# Altium schematic sheet overview.SchDoc
size A4
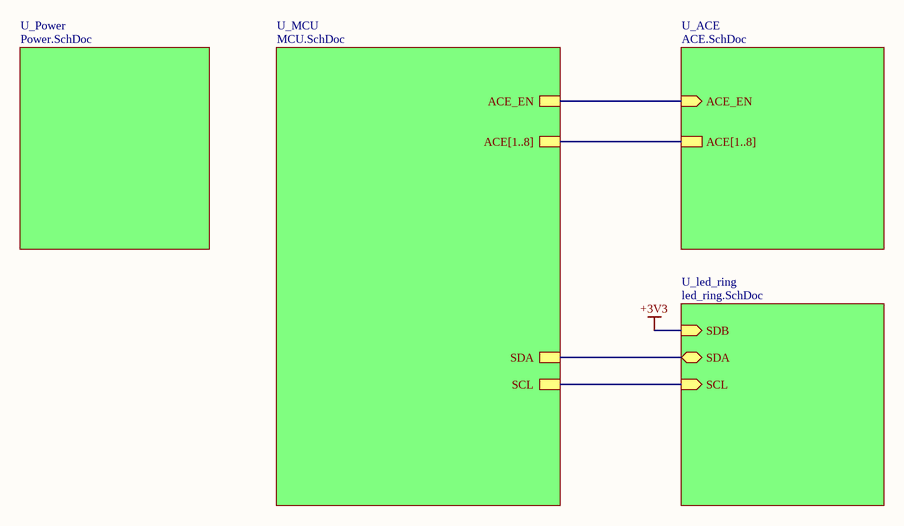
[diagram p0: overview.SchDoc]

## Sub-sheets
U_ACE = ACE.SchDoc: ACE_EN (in), ACE[1..8]
U_led_ring = led_ring.SchDoc: SDA (bidir), SCL (in), SDB (in)
U_MCU = MCU.SchDoc: ACE[1..8], ACE_EN, SDA, SCL
U_Power = Power.SchDoc: no entries

## Nets
+3V3: sheet U_led_ring/SDB
(unnamed): sheet U_ACE/ACE_EN, sheet U_MCU/ACE_EN
(unnamed): sheet U_led_ring/SDA, sheet U_MCU/SDA
(unnamed): sheet U_led_ring/SCL, sheet U_MCU/SCL

## Buses and harness runs
bus sheet U_ACE/ACE[1..8] = sheet U_MCU/ACE[1..8]